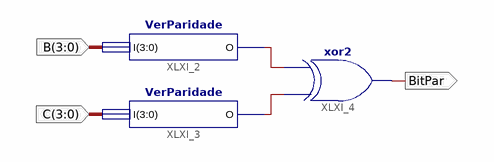
[diagram p0: schematic sheet 1]
// Xilinx ISE schematic verParidadeFinal.sch (spartan3e) as structural Verilog: 3 symbols, 3 ports
module verParidadeFinal (
  input  [3:0] B,
  input  [3:0] C,
  output BitPar
);

  wire XLXN_1, XLXN_2;

  VerParidade XLXI_2 (.I(B), .O(XLXN_1));
  VerParidade XLXI_3 (.I(C), .O(XLXN_2));
  xor XLXI_4 (BitPar, XLXN_2, XLXN_1);
endmodule
